# Altium schematic sheet circuit_1.SchDoc
size A
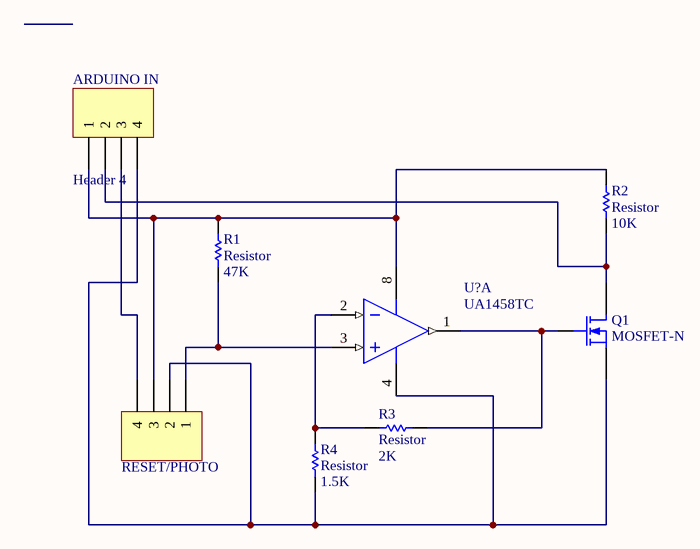
[diagram p0: circuit_1.SchDoc]

## Parts
ARDUINO_IN  Header 4  [HDR1X4]
Q1  MOSFET-N  [E3]
R1  Resistor  value 47K  [RES]
R2  Resistor  value 10K  [RES]
R3  Resistor  value 2K  [RES]
R4  Resistor  value 1.5K  [RES]
RESET/PHOTO  Header 4  [HDR1X4]  (value not drawn)
U?  UA1458TC  [PDIP8]  (part A of 2)

## Nets
NetARDUINO_IN_1: ARDUINO_IN.1 R1.2 R2.2 RESET/PHOTO.3 U?.8(V+)
NetARDUINO_IN_2: ARDUINO_IN.2 Q1.1(D) R2.1
NetARDUINO_IN_3: ARDUINO_IN.3 RESET/PHOTO.4
NetARDUINO_IN_4: ARDUINO_IN.4 Q1.3(S) R4.1 RESET/PHOTO.2 U?.4(V-)
NetQ1_2: Q1.2(G) R3.1 U?.1(OUTA)
NetR1_1: R1.1 RESET/PHOTO.1 U?.3(+INA)
NetR3_2: R3.2 R4.2 U?.2(-INA)

## Library data of the parts
ARDUINO_IN RESET/PHOTO = Header 4: Header, 4-Pin; LatestRevisionDate: 17-Jul-2002; LatestRevisionNote: Re-released for DXP Platform.; Publisher: Altium Limited
Q1 = MOSFET-N: N-Channel MOSFET; Published: 8-Jun-2000; LatestRevisionDate: 17-Jul-2002; LatestRevisionNote: Re-released for DXP Platform.; PackageVersion: 1995/1996; PackageReference: E3; Publisher: Altium Limited; PackageDescription: TO, Flat Index; 3 In-Line, Axial Leads; Body Dia. 4.6mm; Lead Dia. 0.5 mm (max)
U? = UA1458TC: Dual opamp